# Altium schematic sheet Ozone_Sensor.SchDoc
size A; SheetNumber: 10; SheetTotal: 12
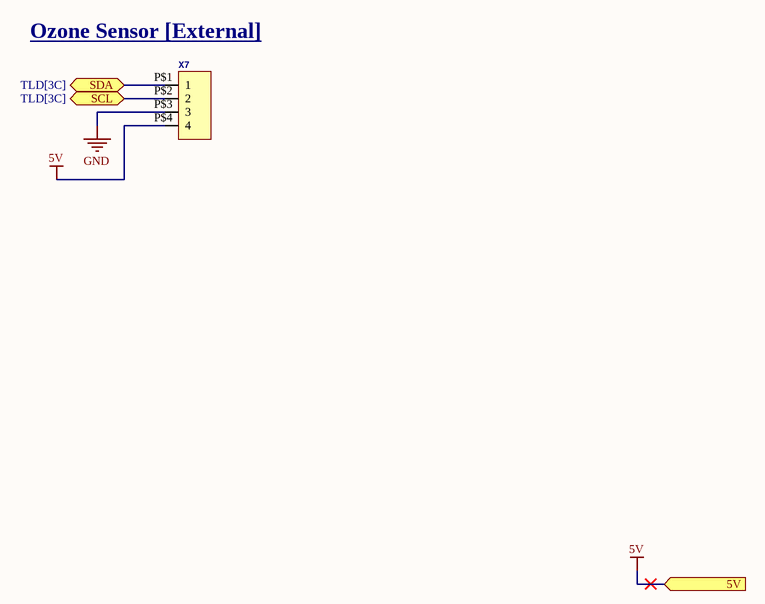
[diagram p0: Ozone_Sensor.SchDoc]

## Parts
X7  Molex - Micro-Fit 3.0 Series connector,  3.00mm (0.118") pitch header, 4 positions.  [43045-0400]  (value not drawn)

## Ports
5V (in), SCL (bidir, see TLD[3C]), SDA (bidir, see TLD[3C])

## Nets
5V: X7.P$4(4) ; port 5V
GND: X7.P$3(3)
SCL: X7.P$2(2) ; port SCL
SDA: X7.P$1(1) ; port SDA

## Notes on the sheet
- (near X7) Ozone Sensor [External]

## Library data of the parts
X7 = HEADER_POS4_?43045-0401: GateName_1: G$1; SymbolName_1: HEADER_POS4; DeviceName: 43045-0401; LibraryName: con-molex-micro-fit-3_0_2; DeviceSetName: HEADER_POS4_?; Package: 43045-0400